# Altium schematic sheet Control_Circuit.SchDoc
size 330 x 355 mm; SheetNumber: 2; SheetTotal: 3
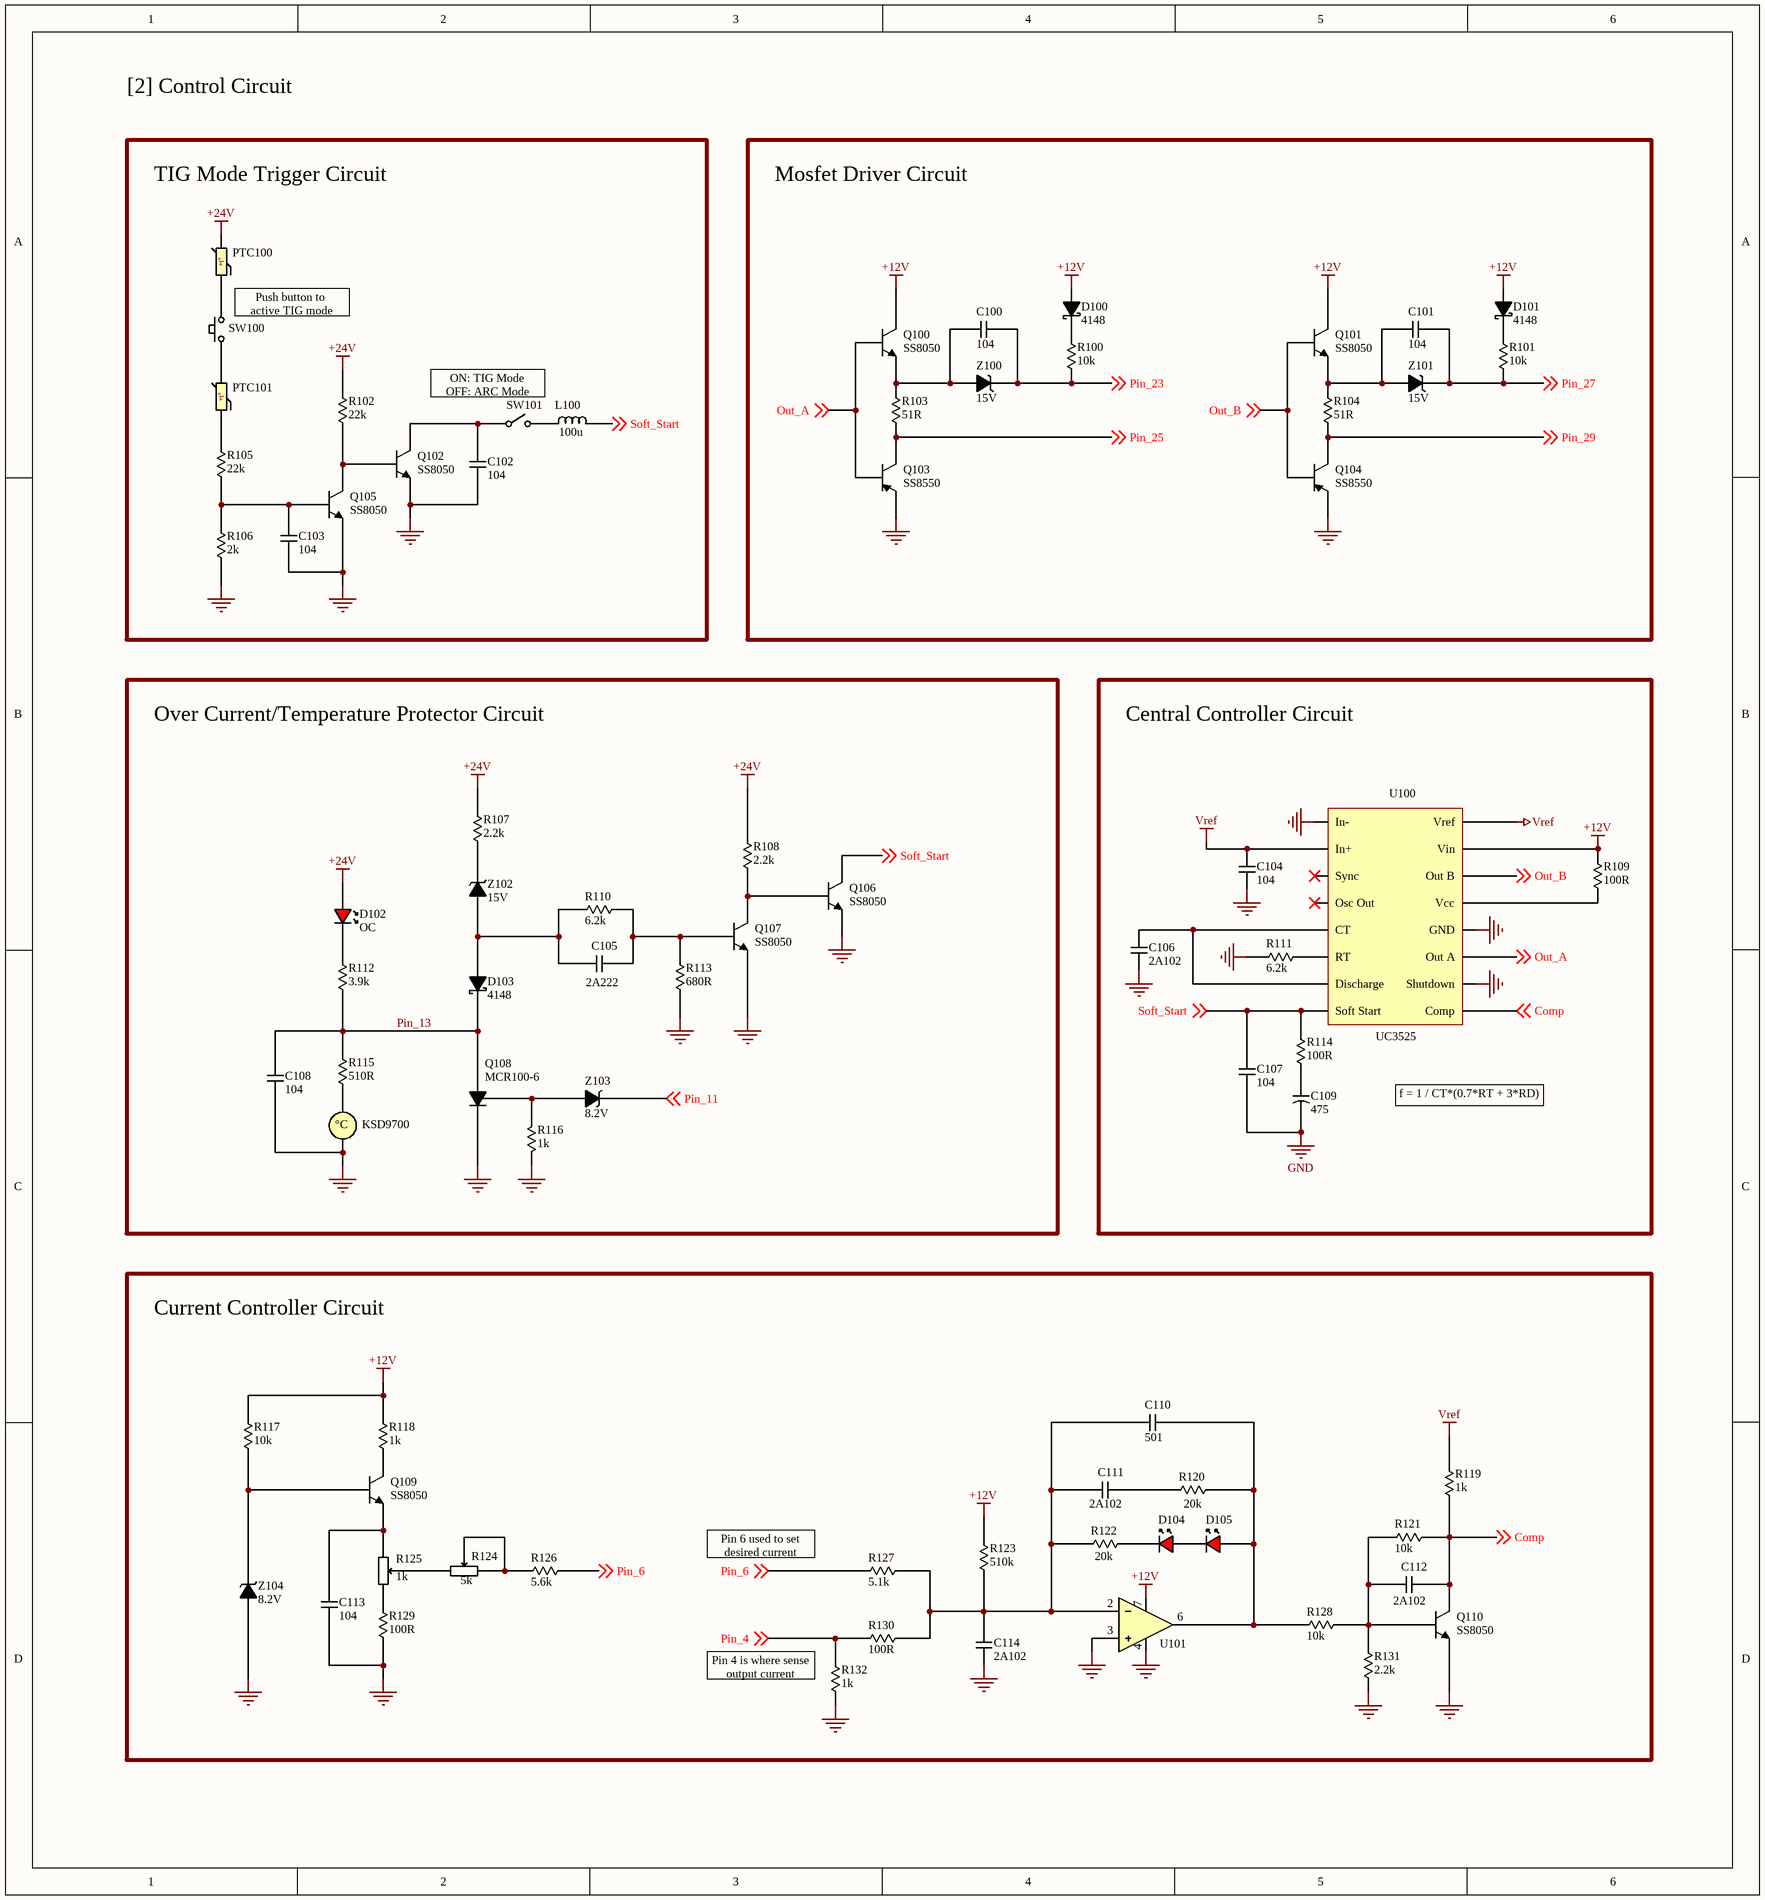
[diagram p0: Control_Circuit.SchDoc]

## Parts
C100  104  [Cap_THD_Ceramic_5mm]
C101  104  [Cap_THD_Ceramic_5mm]
C102  104  [Cap_THD_Ceramic_5mm]
C103  104  [Cap_THD_Ceramic_5mm]
C104  104  [Cap_THD_Ceramic_5mm]
C105  2A222  [Cap_THD_Ceramic_5mm]
C106  2A102  [Cap_THD_Ceramic_5mm]
C107  104  [Cap_THD_Ceramic_5mm]
C108  104  [Cap_THD_Ceramic_5mm]
C109  475  [Cap_THD_Tantalum_2.5mm]
C110  501  [Cap_THD_Ceramic_5mm]
C111  2A102  [Cap_THD_Ceramic_5mm]
C112  2A102  [Cap_THD_Ceramic_5mm]
C113  104  [Cap_THD_Ceramic_5mm]
C114  2A102  [Cap_THD_Ceramic_5mm]
D100  4148  [Diode_THD_7.1mm]
D101  4148  [Diode_THD_7.1mm]
D102  OC  [Led_SMD_0805]
D103  4148  [Diode_THD_7.1mm]
D104  D  [Led_SMD_0805]  (value not drawn)
D105  D  [Led_SMD_0805]  (value not drawn)
L100  100u  [Inductor_THD_5mm]
PTC100  PTC  [PTC_THD_5mm]  (value not drawn)
PTC101  PTC  [PTC_THD_5mm]  (value not drawn)
Q100  SS8050  [TO92]
Q101  SS8050  [TO92]
Q102  SS8050  [TO92]
Q103  SS8550  [TO92]
Q104  SS8550  [TO92]
Q105  SS8050  [TO92]
Q106  SS8050  [TO92]
Q107  SS8050  [TO92]
Q108  MCR100-6  [TO92 - 2.54mm]
Q109  SS8050  [TO92]
Q110  SS8050  [TO92]
R100  10k  [Res_THD_0.25W_10mm]
R101  10k  [Res_THD_0.25W_10mm]
R102  22k  [Res_THD_0.25W_10mm]
R103  51R  [Res_THD_0.25W_10mm]
R104  51R  [Res_THD_0.25W_10mm]
R105  22k  [Res_THD_0.25W_10mm]
R106  2k  [Res_THD_0.25W_10mm]
R107  2.2k  [Res_THD_0.25W_10mm]
R108  2.2k  [Res_THD_0.25W_10mm]
R109  100R  [Res_THD_0.25W_10mm]
R110  6.2k  [Res_THD_0.25W_10mm]
R111  6.2k  [Res_THD_0.25W_10mm]
R112  3.9k  [Res_THD_0.25W_10mm]
R113  680R  [Res_THD_0.25W_10mm]
R114  100R  [Res_THD_0.25W_10mm]
R115  510R  [Res_THD_0.25W_10mm]
R116  1k  [Res_THD_0.25W_10mm]
R117  10k  [Res_THD_0.25W_10mm]
R118  1k  [Res_THD_0.25W_10mm]
R119  1k  [Res_THD_0.25W_10mm]
R120  20k  [Res_THD_0.25W_10mm]
R121  10k  [Res_THD_0.25W_10mm]
R122  20k  [Res_THD_0.25W_10mm]
R123  510k  [Res_THD_0.25W_10mm]
R124  5k  [Trimmer_2.54mm]
R125  1k  [Trimmer_2.54mm]
R126  5.6k  [Res_THD_0.25W_10mm]
R127  5.1k  [Res_THD_0.25W_10mm]
R128  10k  [Res_THD_0.25W_10mm]
R129  100R  [Res_THD_0.25W_10mm]
R130  100R  [Res_THD_0.25W_10mm]
R131  2.2k  [Res_THD_0.25W_10mm]
R132  1k  [Res_THD_0.25W_10mm]
RL100  KSD9700  [CONN_XH_2P_2.5mm]
SW100  SW  [Button_2PIN]  (value not drawn)
SW101  SW  [Button_2PIN]  (value not drawn)
U100  UC3525  [DIP16]
U101  CA3140  [DIP8]  (value not drawn)
Z100  15V  [Diode_THD_7.1mm]
Z101  15V  [Diode_THD_7.1mm]
Z102  15V  [Diode_THD_7.1mm]
Z103  8.2V  [Diode_THD_7.1mm]
Z104  8.2V  [Diode_THD_7.1mm]

## Blocks framed on the sheet
TIG Mode Trigger Circuit: C102 C103 L100 PTC100 PTC101 Q102 Q105 R102 R105 R106 SW100 SW101
Mosfet Driver Circuit: C100 C101 D100 D101 Q100 Q101 Q103 Q104 R100 R101 R103 R104 Z100 Z101
Over Current/Temperature Protector Circuit: C105 C108 D102 D103 Q106-Q108 R107 R108 R110 R112 R113 R115 R116 RL100 Z102 Z103
Central Controller Circuit: C104 C106 C107 C109 R109 R111 R114 U100
Current Controller Circuit: C110-C114 D104 D105 Q109 Q110 R117-R132 U101 Z104

## Nets
+12V: D100.2(A) D101.2(A) Q100.3(C) Q101.3(C) R109.3 R117.3 R118.3 R123.4 U100.15(Vin) U101.7(V+)
+24V: D102.2(A) PTC100.2 R102.3 R107.3 R108.4
GND: C102.1 C103.1 C104.1 C106.1 C107.2 C108.1 C109.2(-) C113.1 C114.2 Q102.1(E) Q103.1(E) Q104.1(E) Q105.1(E) Q106.1(E) Q107.1(E) Q108.2(K) Q110.1(E) R106.4 R111.4 R113.3 R116.4 R129.4 R131.3 R132.4 RL100.2 U100.1(In-) U100.10(Shutdown) U100.12(GND) U101.3(In+) U101.4(V-) Z104.2(A)
Vref: C104.2 R119.4 U100.2(In+) U100.16(Vref)
Comp: C112.1 Q110.3(C) R119.3 R121.4 U100.9(Comp) ; off-sheet Comp
Out_A: Q100.2(B) Q103.2(B) U100.11(Out_A) ; off-sheet Out_A
Out_B: Q101.2(B) Q104.2(B) U100.14(Out_B) ; off-sheet Out_B
Pin_4: R130.4 R132.3 ; off-sheet Pin_4
Pin_6: R126.4 R127.4 ; off-sheet Pin_6
Pin_11: Z103.1(K) ; off-sheet Pin_11
Pin_13: C108.2 D103.1(K) Q108.1(A) R112.4 R115.3
Pin_23: C100.2 R100.4 Z100.1(K) ; off-sheet Pin_23
Pin_25: Q103.3(C) R103.4 ; off-sheet Pin_25
Pin_27: C101.2 R101.4 Z101.1(K) ; off-sheet Pin_27
Pin_29: Q104.3(C) R104.4 ; off-sheet Pin_29
Soft_Start: C107.1 L100.2 Q106.3(C) R114.4 U100.8(Soft_Start) ; off-sheet Soft_Start
NetC100_1: C100.1 Q100.1(E) R103.3 Z100.2(A)
NetC101_1: C101.1 Q101.1(E) R104.3 Z101.2(A)
NetC102_2: C102.2 Q102.3(C) SW101.1
NetC103_2: C103.2 Q105.2(B) R105.4 R106.3
NetC105_1: C105.1 Q107.2(B) R110.4 R113.4
NetC105_2: C105.2 D103.2(A) R110.3 Z102.2(A)
NetC106_2: C106.2 U100.5(CT) U100.7(Discharge)
NetC109_1: C109.1(+) R114.3
NetC110_1: C110.1 D105.2(A) R120.4 R128.3 U101.6(Out)
NetC110_2: C110.2 C111.2 C114.1 R122.3 R123.3 R127.3 R130.3 U101.2(In-)
NetC111_1: C111.1 R120.3
NetC112_2: C112.2 Q110.2(B) R121.3 R128.4 R131.4
NetC113_2: C113.2 Q109.1(E) R125.1
NetD100_1: D100.1(K) R100.3
NetD101_1: D101.1(K) R101.3
NetD102_1: D102.1(K) R112.3
NetD104_1: D104.1(K) R122.4
NetD104_2: D104.2(A) D105.1(K)
NetL100_1: L100.1 SW101.2
NetPTC100_1: PTC100.1 SW100.2
NetPTC101_1: PTC101.1 R105.3
NetPTC101_2: PTC101.2 SW100.1
NetQ102_2: Q102.2(B) Q105.3(C) R102.4
NetQ106_2: Q106.2(B) Q107.3(C) R108.3
NetQ108_3: Q108.3(G) R116.3 Z103.2(A)
NetQ109_2: Q109.2(B) R117.4 Z104.1(K)
NetQ109_3: Q109.3(C) R118.4
NetR107_4: R107.4 Z102.1(K)
NetR109_4: R109.4 U100.13(Vcc)
NetR111_3: R111.3 U100.6(RT)
NetR115_4: R115.4 RL100.1
NetR124_1: R124.1 R125.2
NetR124_2: R124.2 R124.3 R126.3
NetR125_3: R125.3 R129.3

Not connected (* = marked no-connect by the designer): U100 3(Sync)* 4(Osc_Out)*

## Notes on the sheet
- [2] Control Circuit
- Push button to
  active TIG mode
- ON: TIG Mode
  OFF: ARC Mode
- f = 1 / CT*(0.7*RT + 3*RD)
- Pin 6 used to set desired current
- (near R132) Pin 4 is where sense output current
- (in symbol PTC) +t°
- (in symbol Relay_KSD9700) °C

## Library data of the parts
C100-C108 C110-C114 = Cap_THD_Ceramic_5mm: 5mm THD Ceramic Capacitor; Voltage: V
C109 = Cap_THD_Tantalum_2.5mm: Voltage: V
D100 D101 D103 = 1N4148: Rectifier Diode Small Signal Switching 100V 0.2A 4ns Automotive 2-Pin DO-35 Ammo; Manufacturer: NXP Semiconductors; Forward Current: 200mA; Capacitance: 4pF; Polarity: Standard; Max Forward Surge Current (Ifsm): 4A; Element Configuration: Single; Supplier 1: Arrow Electronics; Manufacturer Part Number: 1N4148; RoHS: Yes; Category: Uncategorized; Case/Package: SOD; Number of Pins: 2; Max Operating Temperature: 200°C; Packaging: Ammo Pack; Reverse Recovery Time: 4ns; Max Repetitive Reverse Voltage (Vrrm): 100V; Current Rating: 200mA; Voltage Rating (DC): 100V; Output Current: 200mA; Current: 4A; Voltage: 100V; RoHS Compliant: Yes; Lead Free: Lead Free; Reach SVHC Compliant: No; ComponentLink1URL: https://datasheet.ciiva.com/1179/1720485-1179297.pdf?src-supplier=Element14; ComponentLink1Description: https://datasheet.ciiva.com/1179/1720485-1179297.pdf?src-supplier=Element14; ComponentLink2URL: https://datasheet.ciiva.com/26921/getdatasheetpartid-764103-26921186.pdf?src-supplier=Verical; ComponentLink2Description: https://datasheet.ciiva.com/26921/getdatasheetpartid-764103-26921186.pdf?src-supplier=Verical; Supplier Part Number 1: 1N4148
D102 D104 D105 = LED Red
L100 = Inductor: Generic Inductor
Q100-Q102 Q105-Q107 Q109 Q110 = SS8050: Bipolar Transistor BJT NPN Epitaxial Silicon 25V 1500mA 100MHz 1W TO-92-3; Manufacturer: ON Semiconductor / Fairchild; Manufacturer Part Number: SS8050DTA; Max Collector Current: 1.5A; Collector-emitter Voltage-Max: 500mV; hFE Min: 85; Collector Base Voltage (VCBO): 40V; Emitter Base Voltage (VEBO): 6V; Supplier 1: Future Electronics; RoHS: Yes; Category: BJTs; Stock 1: 10000; Pricing 1: 2000=0.0536, 6000=0.0516, 20000=0.0496, 40000=0.0484, 80000=0.0463 (USD); Mount: Through Hole; Case/Package: TO-92-3; Number of Pins: 3; Weight: 0.24g; Min Operating Temperature: -65°C; Max Operating Temperature: 150°C; Packaging: Ammo Pack; Series: -; Package Quantity: 2000; Max Power Dissipation: 1W; Transition Frequency: 100MHz; Collector Emitter Breakdown Voltage: 25V; Polarity: NPN; Collector Emitter Saturation Voltage: 500mV; Gain Bandwidth Product: 100MHz; Voltage Rating (DC): 25V; Collector Emitter Voltage (VCEO): 25V; Max Breakdown Voltage: 25V; Current Rating: 1.5A; Length: 4.58mm; Width: 3.86mm; Height: 4.58mm; Radiation Hardening: No; RoHS Compliant: Yes; Lead Free: Lead Free; Reach SVHC Compliant: No; ComponentLink1URL: https://datasheet.ciiva.com/4721/ss8050-117753-4721333.pdf?src-supplier=Mouser; ComponentLink1Description: https://datasheet.ciiva.com/4721/ss8050-117753-4721333.pdf?src-supplier=Mouser; ComponentLink2URL: https://datasheet.ciiva.com/11207/ss8050-11207512.pdf?src-supplier=Avnet; ComponentLink2Description: https://datasheet.ciiva.com/11207/ss8050-11207512.pdf?src-supplier=Avnet; ComponentLink3URL: https://datasheet.ciiva.com/18648/ss8050-18648133.pdf?src-supplier=Digi-Key; ComponentLink3Description: https://datasheet.ciiva.com/18648/ss8050-18648133.pdf?src-supplier=Digi-Key; ComponentLink4URL: https://datasheet.ciiva.com/17447/ss8050-17447834.pdf?src-supplier=Future+Electronics; ComponentLink4Description: https://datasheet.ciiva.com/17447/ss8050-17447834.pdf?src-supplier=Future+Electronics; ComponentLink5URL: https://datasheet.ciiva.com/46415/1868828-46415608.pdf?src-supplier=Element14; ComponentLink5Description: https://datasheet.ciiva.com/46415/1868828-46415608.pdf?src-supplier=Element14; Supplier Part Number 1: 7178421
Q103 Q104 = SS8550: Bipolar Transistor BJT PNP Epitaxial Silicon 25V 1500mA 200MHz 1W TO-92-3; Manufacturer: ON Semiconductor / Fairchild; Manufacturer Part Number: SS8550DTA; hFE Min: 85; Max Collector Current: 1.5A; Collector Base Voltage (VCBO): -40V; Emitter Base Voltage (VEBO): -6V; Collector Emitter Saturation Voltage: -280mV; Voltage Rating (DC): -25V; Collector-emitter Voltage-Max: 500mV; Current Rating: -1.5A; Number of Elements: 1; Supplier 1: Arrow Electronics; RoHS: Yes; Category: BJTs; Stock 1: 13550; Pricing 1: 1=0.3913, 10=0.2848, 25=0.282, 100=0.1142, 250=0.1131, 500=0.1081, 1000=0.0671, 3000=0.0643, 6000=0.0553 (USD); Mount: Through Hole; Case/Package: TO-92-3; Number of Pins: 3; Weight: 0.24g; Min Operating Temperature: -65°C; Max Operating Temperature: 150°C; Series: -; Packaging: Ammo Pack; Polarity: PNP; Package Quantity: 2000; Max Power Dissipation: 1W; Transition Frequency: 200MHz; Collector Emitter Breakdown Voltage: 25V; Gain Bandwidth Product: 200MHz; Collector Emitter Voltage (VCEO): 25V; Frequency: 200MHz; Max Breakdown Voltage: 25V; Power Dissipation: 1W; Max Frequency: 200MHz; Radiation Hardening: No; Lead Free: Lead Free; RoHS Compliant: Yes; Reach SVHC Compliant: No; ComponentLink1URL: https://datasheet.ciiva.com/25625/0900766b80f9b5d4-25625990.pdf?src-supplier=Rs; ComponentLink1Description: https://datasheet.ciiva.com/25625/0900766b80f9b5d4-25625990.pdf?src-supplier=Rs; ComponentLink2URL: https://datasheet.ciiva.com/4721/ss8550-118608-4721282.pdf?src-supplier=Mouser; ComponentLink2Description: https://datasheet.ciiva.com/4721/ss8550-118608-4721282.pdf?src-supplier=Mouser; ComponentLink3URL: https://datasheet.ciiva.com/46415/1869982-46415611.pdf?src-supplier=Element14; ComponentLink3Description: https://datasheet.ciiva.com/46415/1869982-46415611.pdf?src-supplier=Element14; Supplier Part Number 1: SS8550DTA
Q108 = SCR_MCR100_6_V1: Thyristor SCR 400V 10A 3-Pin TO-92 Tape and Ammo; Manufacturer: ON Semiconductor; Manufacturer Part Number: MCR100-6ZL1G; Hold Current: 5mA; Current Rating: 800mA; Supplier 1: Avnet; RoHS: Yes; Category: SCRs; Stock 1: 1846; Case/Package: TO-92-3; Number of Pins: 3; Min Operating Temperature: -40°C; Max Operating Temperature: 110°C; Voltage Rating (DC): 400V; Packaging: Tape and Reel; Series: -; Package Quantity: 2000; RMS Current (Irms): 800mA; Max Repetitive Reverse Voltage (Vrrm): 400V; Radiation Hardening: No; RoHS Compliant: Yes; Lead Free: Lead Free; ComponentLink1URL: https://datasheet.ciiva.com/3054/mcr100-d-3054696.pdf?src-supplier=Avnet; ComponentLink1Description: https://datasheet.ciiva.com/3054/mcr100-d-3054696.pdf?src-supplier=Avnet; ComponentLink2URL: https://datasheet.ciiva.com/6366/mcr100-d-6366847.pdf?src-supplier=Digi-Key; ComponentLink2Description: https://datasheet.ciiva.com/6366/mcr100-d-6366847.pdf?src-supplier=Digi-Key; ComponentLink3URL: https://datasheet.ciiva.com/16453/mcr100-d-16453261.pdf?src-supplier=Future+Electronics; ComponentLink3Description: https://datasheet.ciiva.com/16453/mcr100-d-16453261.pdf?src-supplier=Future+Electronics; Supplier Part Number 1: MCR100-6ZL1G
R100-R123 R126-R132 = Res_THD_0.25W: 250mW THD Resistor; Power Rating: 0.25W
R124 R125 = Trimmer
RL100 = Relay_KSD9700: KSD-9700 series thermal protector
SW100 = Switch Button
SW101 = Switch Toggle
U101 = CA3140: CA140 Series 4.5 MHz 9 V/us 36 V BiMOS Operational Amplifier - PDIP-8; Manufacturer: Renesas; Manufacturer Part Number: CA3140EZ; Supplier 1: Mouser; RoHS: Yes; Category: Amplifiers - Op Amps, Buffer, Instrumentation; Stock 1: 16980; Pricing 1: 1=3.29, 10=2.95, 50=2.95, 100=2.42, 1000=1.73, 10000=1.58 (USD); ComponentLink1URL: https://www.renesas.com/en-us/www/doc/datasheet/ca3140-a.pdf?src-supplier=Digi-Key; ComponentLink1Description: https://www.renesas.com/en-us/www/doc/datasheet/ca3140-a.pdf?src-supplier=Digi-Key; Supplier Part Number 1: 968-CA3140EZ
Z100-Z104 = Diode_THD_Zener: 10mm Axial Zener Diode